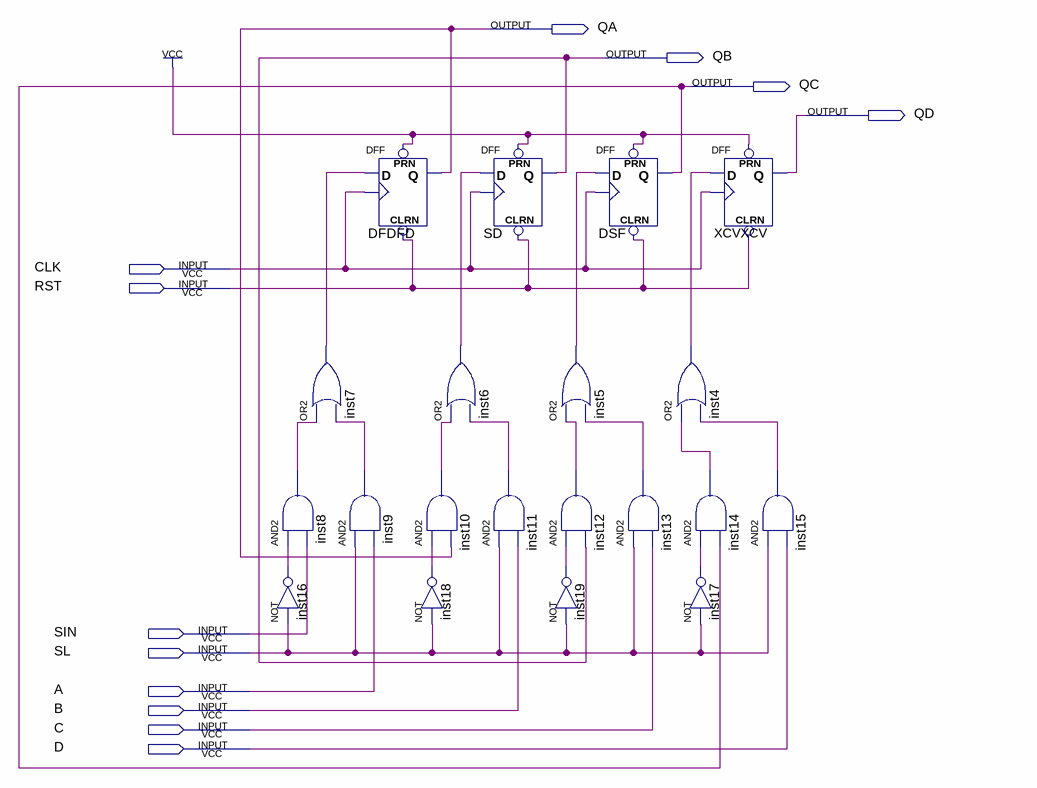
[diagram p0: schematic sheet]
// Quartus schematic ex8 - Copy.bdf as structural Verilog: 20 symbols, 12 pins
module \ex8_-_Copy  (
  input  CLK,
  input  RST,
  input  SIN,
  input  SL,
  input  A,
  input  B,
  input  C,
  input  D,
  output QA,
  output QB,
  output QC,
  output QD
);

  wire inst4_out, inst5_out, inst6_out, inst7_out, inst8_out, inst9_out, inst10_out, inst11_out, inst12_out,
       inst13_out, inst14_out, inst15_out, inst16_out, inst17_out, inst18_out, inst19_out;

  or inst7 (inst7_out, inst8_out, inst9_out);
  and inst8 (inst8_out, inst16_out, SIN);
  not inst16 (inst16_out, SL);
  DFF DFDFD (.CLRN(RST), .CLK(CLK), .D(inst7_out), .PRN(1'b1), .Q(QA));
  and inst9 (inst9_out, SL, A);
  DFF SD (.CLRN(RST), .CLK(CLK), .D(inst6_out), .PRN(1'b1), .Q(QB));
  or inst6 (inst6_out, inst10_out, inst11_out);
  and inst10 (inst10_out, inst18_out, QA);
  and inst11 (inst11_out, SL, B);
  not inst18 (inst18_out, SL);
  or inst5 (inst5_out, inst12_out, inst13_out);
  and inst12 (inst12_out, inst19_out, QB);
  not inst19 (inst19_out, SL);
  DFF DSF (.CLRN(RST), .CLK(CLK), .D(inst5_out), .PRN(1'b1), .Q(QC));
  and inst13 (inst13_out, SL, C);
  DFF XCVXCV (.CLRN(RST), .CLK(CLK), .D(inst4_out), .PRN(1'b1), .Q(QD));
  or inst4 (inst4_out, inst14_out, inst15_out);
  and inst14 (inst14_out, inst17_out, QC);
  not inst17 (inst17_out, SL);
  and inst15 (inst15_out, SL, D);
endmodule
